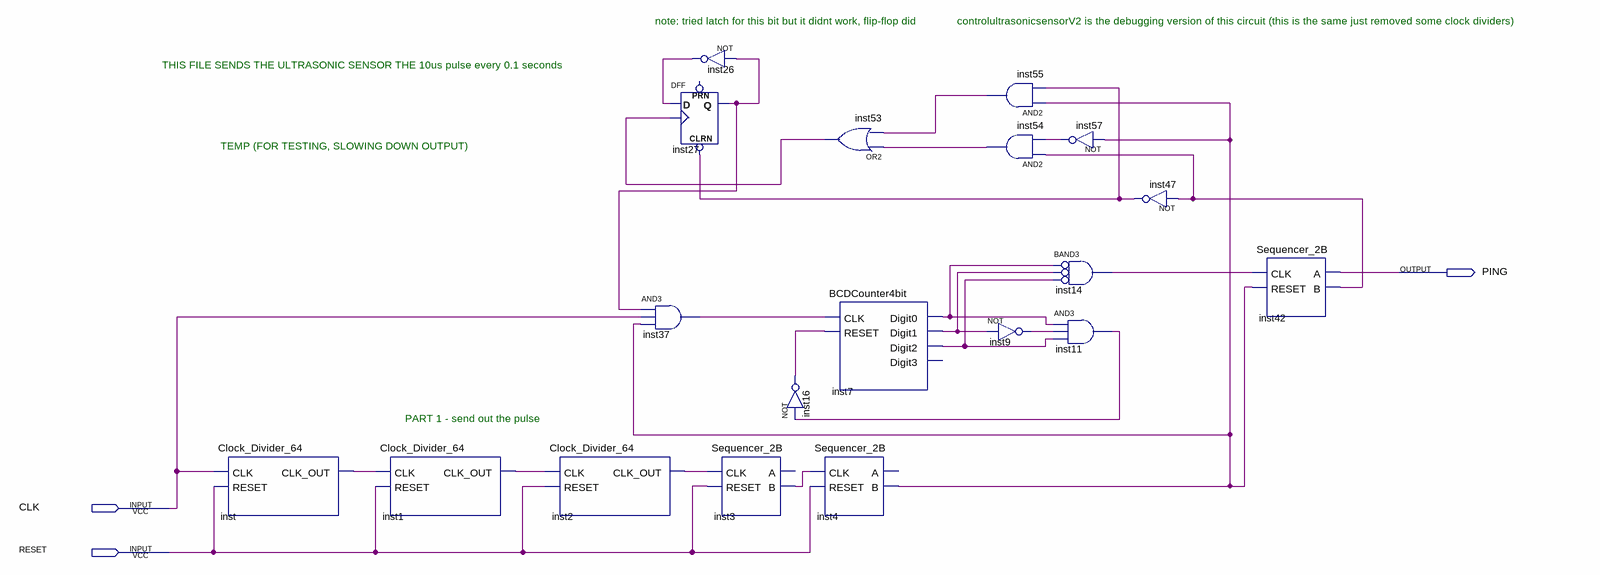
[diagram p0: schematic sheet]
// Quartus schematic controlultrasonicsensorfinal.bdf as structural Verilog: 19 symbols, 3 pins
module controlultrasonicsensorfinal (
  input  CLK,
  input  RESET,
  output PING
);

  wire inst1_clk_out, inst2_clk_out, inst3_b, inst4_b, inst7_digit0, inst7_digit1, inst7_digit2, inst9_out,
       inst11_out, inst14_out, inst16_out, inst26_out, inst27_q, inst37_out, inst42_b, inst47_out,
       inst53_out, inst54_out, inst55_out, inst57_out, inst_clk_out;

  Clock_Divider_64 inst (.CLK(CLK), .RESET(RESET), .CLK_OUT(inst_clk_out));
  Clock_Divider_64 inst1 (.CLK(inst_clk_out), .RESET(RESET), .CLK_OUT(inst1_clk_out));
  Clock_Divider_64 inst2 (.CLK(inst1_clk_out), .RESET(RESET), .CLK_OUT(inst2_clk_out));
  DFF inst27 (.CLRN(inst47_out), .CLK(inst53_out), .D(inst26_out), .Q(inst27_q));  // open: PRN
  and inst37 (inst37_out, inst27_q, CLK, inst4_b);
  not inst26 (inst26_out, inst27_q);
  Sequencer_2B inst3 (.CLK(inst2_clk_out), .RESET(RESET), .B(inst3_b));  // open: A
  not inst16 (inst16_out, inst11_out);
  or inst53 (inst53_out, inst54_out, inst55_out);
  BCDCounter4bit inst7 (
    .CLK(inst37_out), .RESET(inst16_out), .Digit0(inst7_digit0), .Digit1(inst7_digit1), .Digit2(inst7_digit2));  // open: Digit3
  Sequencer_2B inst4 (.CLK(inst3_b), .RESET(RESET), .B(inst4_b));  // open: A
  and inst55 (inst55_out, inst4_b, inst47_out);
  and inst54 (inst54_out, inst42_b, inst57_out);
  not inst9 (inst9_out, inst7_digit1);
  not inst57 (inst57_out, inst4_b);
  and inst14 (inst14_out, ~inst7_digit0, ~inst7_digit1, ~inst7_digit2);  // BAND3
  and inst11 (inst11_out, inst7_digit0, inst9_out, inst7_digit2);
  not inst47 (inst47_out, inst42_b);
  Sequencer_2B inst42 (.CLK(inst14_out), .RESET(inst4_b), .A(PING), .B(inst42_b));

  // Notes on the sheet:
  //   note: tried latch for this bit but it didnt work, flip-flop did
  //   controlultrasonicsensorV2 is the debugging version of this circuit (this is the same just removed some clock dividers)
  //   THIS FILE SENDS THE ULTRASONIC SENSOR THE 10us pulse every 0.1 seconds
  //   TEMP (FOR TESTING, SLOWING DOWN OUTPUT)
  //   PART 1 - send out the pulse
endmodule
